# EAGLE design SNES USB-C (EAGLE 6.2)
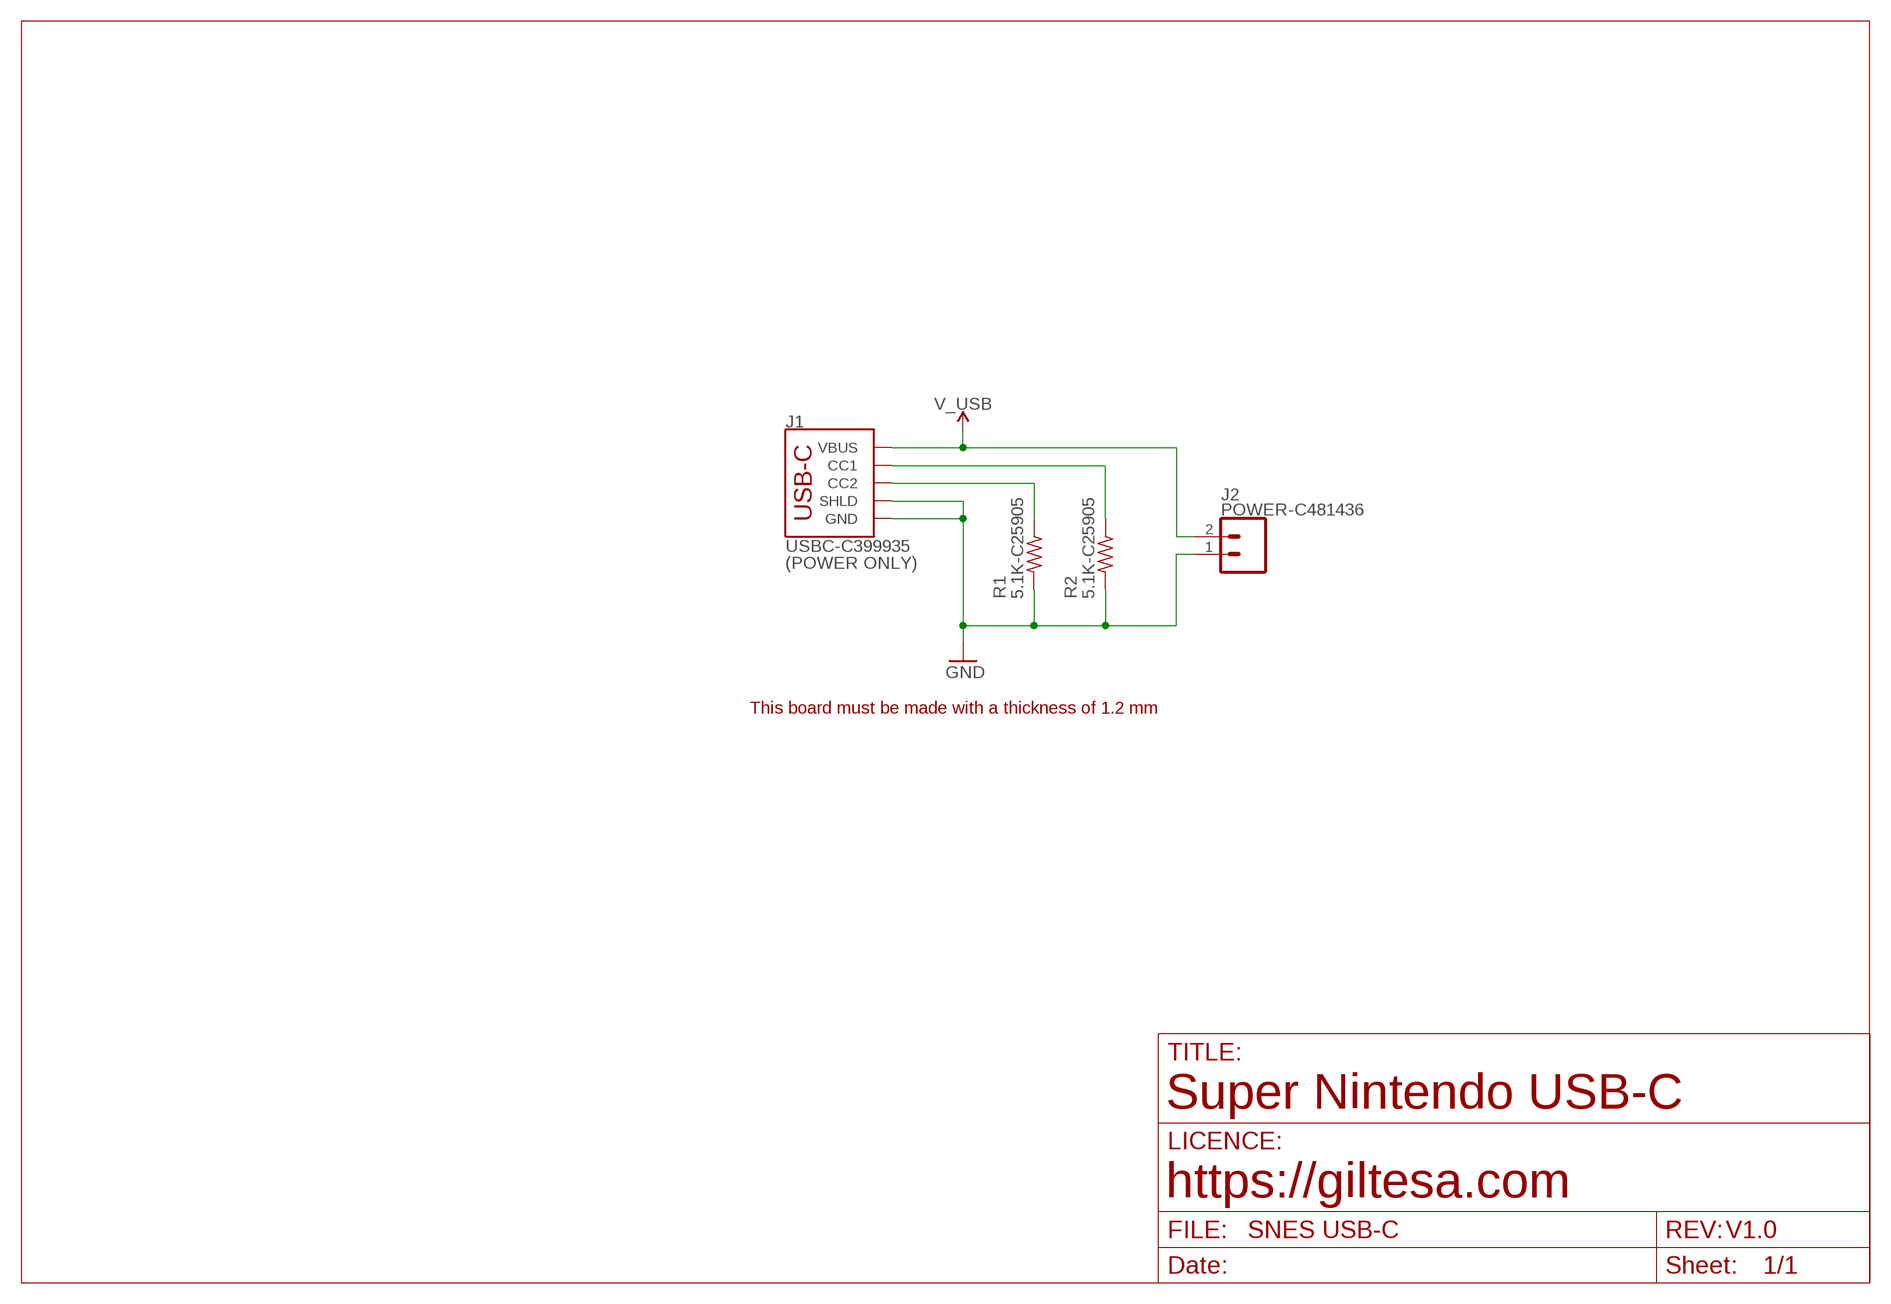
[diagram p0: schematic, sheet 1]

## Parts
J1  USBC-C399935  USB-C_6P_POWER_SIDE  [USB-C_6P_SIDE]
J2  POWER-C481436  JST-2_1.25MM  [JST-2-1.25MM_RIGHT]
R1  5.1K-C25905  R0402  [R0402]
R2  5.1K-C25905  R0402  [R0402]

## Nets
GND: J1.A12-GND(GND) J1.B12-GND(GND) J1.SHLD1(SHLD) J1.SHLD2(SHLD) J1.SHLD3(SHLD) J1.SHLD4(SHLD) J2.1 R1.2 R2.2
N$4: J1.B5(CC2) R1.1
N$13: J1.A5(CC1) R2.1
V_USB: J1.A9-VBUS(VBUS) J1.B9-VBUS(VBUS) J2.2

## Notes on the sheet
- (POWER ONLY)
- This board must be made with a thickness of 1.2 mm
- Super Nintendo USB-C
- https://giltesa.com
- V1.0

## Library data of the parts
J1 = ,giltesa:USB-C_6P
J2 = ,giltesa:JST-2
R1 R2 = ,giltesa:R0402

## Net classes
1 power: width 0.61 mm, drill 0.406 mm, clearance 0.203 mm
2 gnd: width 0.305 mm, drill 0.406 mm, clearance 0.203 mm
3 power usb: width 0.508 mm, drill 0.406 mm, clearance 0.203 mm

## Board
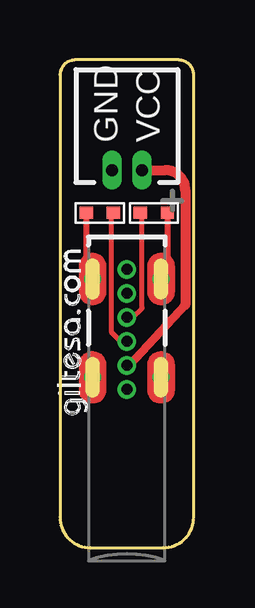
[diagram p1: board, top side]
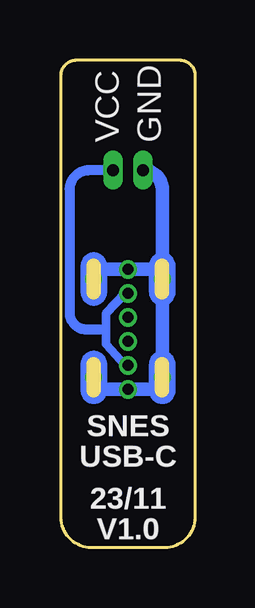
[diagram p2: board, bottom side, seen from below]

Size 5.59 x 20.32 mm. Coordinates in mm from the lower left corner, seen from the top.
Outline: 4.32,0 arc90 5.59,1.27 5.59,19.69 arc90 4.95,20.32 0.64,20.32 arc90 0,19.69 0,1.27 arc90 1.27,0 4.32,0
Copper layers (1*16): Top 0.035mm / dielectric 1.6mm / Bottom 0.035mm
Design rules: minimum track width 6mil, minimum drill 12mil, track to track 6mil, track to pad 6mil, pad to pad 6mil, via to via 8mil, smd to smd 0mil, copper to edge 20mil, drill to drill 10mil, minimum pad ring 6mil, minimum via ring 6mil, stop-mask expansion 0mil, vias tented up to drill 100mil, thermal gap 10mil

### Footprints (pad centres in the part's own frame; a part is rotated, then mirrored left to right if it is on the bottom)
USB-C_6P_SIDE = drill 0.457 pad 0.635: A5 0,-0.5; A9-VBUS 0,1.5; A12-GND 0,2.5; B5 0,0.5; B9-VBUS 0,-1.5; B12-GND 0,-2.5 | smd 0.127 x 0.127: SHLD0 -1.43,2.796 | drill 0.4 pad 0.6: SHLD1 -1.43,2.1; SHLD2 1.43,2.1; SHLD3 -1.43,-2; SHLD4 1.43,-2
JST-2-1.25MM_RIGHT = drill 0.5 long: 1 0.625,0; 2 -0.625,0 | smd 0.127 x 0.127: NA 0.625,-0.256
R0402 = smd 0.559 x 0.5: 1 -0.567,0; 2 0.567,0

### Placement (x,y rotation side)
J1  2.79,9.1 0 top
J2  2.79,15.73 180 top
R1  3.92,13.95 0 top
R2  1.67,13.95 180 top
U$11  [GILTESA.COM_MASK_7MM]  1.24,5.5 90 top

### Tracks (layer width: path | path; a pad name or v marks a point on that pad's centre or on a via)
GND
  Top 0.254: R2.2 1.1,11.46 J1.SHLD1 | R1.2 4.49,11.46 J1.SHLD2
  Bottom 0.559: J1.SHLD4 4.22,6.6 J1.B12-GND 1.36,6.6 J1.SHLD3 J1.SHLD1 1.36,11.6 | J1.SHLD2 4.22,11.6 J1.A12-GND 1.36,11.6 | 1.36,11.6 1.36,14.93 arc-90 J2.1
N$4
  Top 0.203: J1.B5 3.04,9.6 3.43,9.98 3.43,13.88 R1.1
N$13
  Top 0.203: J1.A5 2.53,8.6 2.16,8.97 2.16,13.88 R2.1
V_USB
  Top 0.305: 2.82,7.57 2.9,7.57
  Top 0.356: J1.B9-VBUS 2.82,7.57 | 2.9,7.57 4.99,9.85 5.23,10.11
  Top 0.406: 5.23,10.11 5.23,14.91 arc90 4.41,15.73 J2.2
  Bottom 0.305: 2.82,7.57 2.9,7.57
  Bottom 0.356: J1.B9-VBUS 2.82,7.57 | J1.A9-VBUS 2.92,10.6 3.72,9.77 3.72,9.1 | 2.9,7.57 3.72,8.47 3.72,9.1 | 3.72,9.1 3.94,9.1
  Bottom 0.406: 3.94,9.1 4.52,9.1 arc90 5.23,9.78 5.23,14.91 arc90 4.41,15.73 J2.2

### Text on the board
tPlace: GND | VCC
bPlace: GND | VCC | SNES | USB-C | 23/11 | V1.0